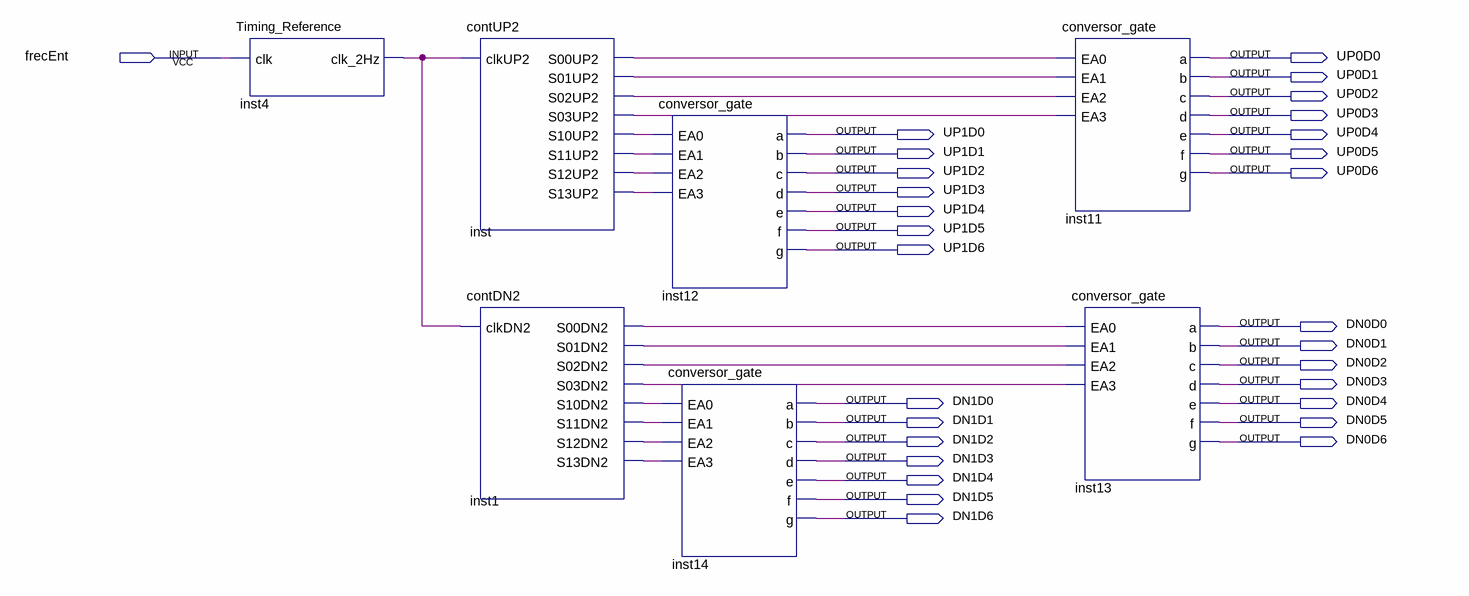
[diagram p0: schematic sheet]
// Quartus schematic contador_e_registrador.bdf as structural Verilog: 7 symbols, 29 pins
module contador_e_registrador (
  input  frecEnt,
  output UP0D0,
  output UP0D1,
  output UP0D2,
  output UP0D3,
  output UP1D0,
  output UP0D4,
  output UP1D1,
  output UP0D5,
  output UP1D2,
  output UP0D6,
  output UP1D3,
  output UP1D4,
  output UP1D5,
  output UP1D6,
  output DN0D0,
  output DN0D1,
  output DN0D2,
  output DN0D3,
  output DN1D0,
  output DN0D4,
  output DN1D1,
  output DN0D5,
  output DN1D2,
  output DN0D6,
  output DN1D3,
  output DN1D4,
  output DN1D5,
  output DN1D6
);

  wire inst1_s00dn2, inst1_s01dn2, inst1_s02dn2, inst1_s03dn2, inst1_s10dn2, inst1_s11dn2, inst1_s12dn2,
       inst1_s13dn2, inst4_clk_2hz, inst_s00up2, inst_s01up2, inst_s02up2, inst_s03up2, inst_s10up2,
       inst_s11up2, inst_s12up2, inst_s13up2;

  Timing_Reference inst4 (.clk(frecEnt), .clk_2Hz(inst4_clk_2hz));
  contUP2 inst (
    .clkUP2(inst4_clk_2hz), .S00UP2(inst_s00up2), .S01UP2(inst_s01up2), .S02UP2(inst_s02up2),
    .S03UP2(inst_s03up2), .S10UP2(inst_s10up2), .S11UP2(inst_s11up2), .S12UP2(inst_s12up2),
    .S13UP2(inst_s13up2));
  contDN2 inst1 (
    .clkDN2(inst4_clk_2hz), .S00DN2(inst1_s00dn2), .S01DN2(inst1_s01dn2), .S02DN2(inst1_s02dn2),
    .S03DN2(inst1_s03dn2), .S10DN2(inst1_s10dn2), .S11DN2(inst1_s11dn2), .S12DN2(inst1_s12dn2),
    .S13DN2(inst1_s13dn2));
  conversor_gate inst12 (
    .EA0(inst_s10up2), .EA1(inst_s11up2), .EA2(inst_s12up2), .EA3(inst_s13up2), .a(UP1D0), .b(UP1D1),
    .c(UP1D2), .d(UP1D3), .e(UP1D4), .f(UP1D5), .g(UP1D6));
  conversor_gate inst14 (
    .EA0(inst1_s10dn2), .EA1(inst1_s11dn2), .EA2(inst1_s12dn2), .EA3(inst1_s13dn2), .a(DN1D0), .b(DN1D1),
    .c(DN1D2), .d(DN1D3), .e(DN1D4), .f(DN1D5), .g(DN1D6));
  conversor_gate inst11 (
    .EA0(inst_s00up2), .EA1(inst_s01up2), .EA2(inst_s02up2), .EA3(inst_s03up2), .a(UP0D0), .b(UP0D1),
    .c(UP0D2), .d(UP0D3), .e(UP0D4), .f(UP0D5), .g(UP0D6));
  conversor_gate inst13 (
    .EA0(inst1_s00dn2), .EA1(inst1_s01dn2), .EA2(inst1_s02dn2), .EA3(inst1_s03dn2), .a(DN0D0), .b(DN0D1),
    .c(DN0D2), .d(DN0D3), .e(DN0D4), .f(DN0D5), .g(DN0D6));
endmodule
